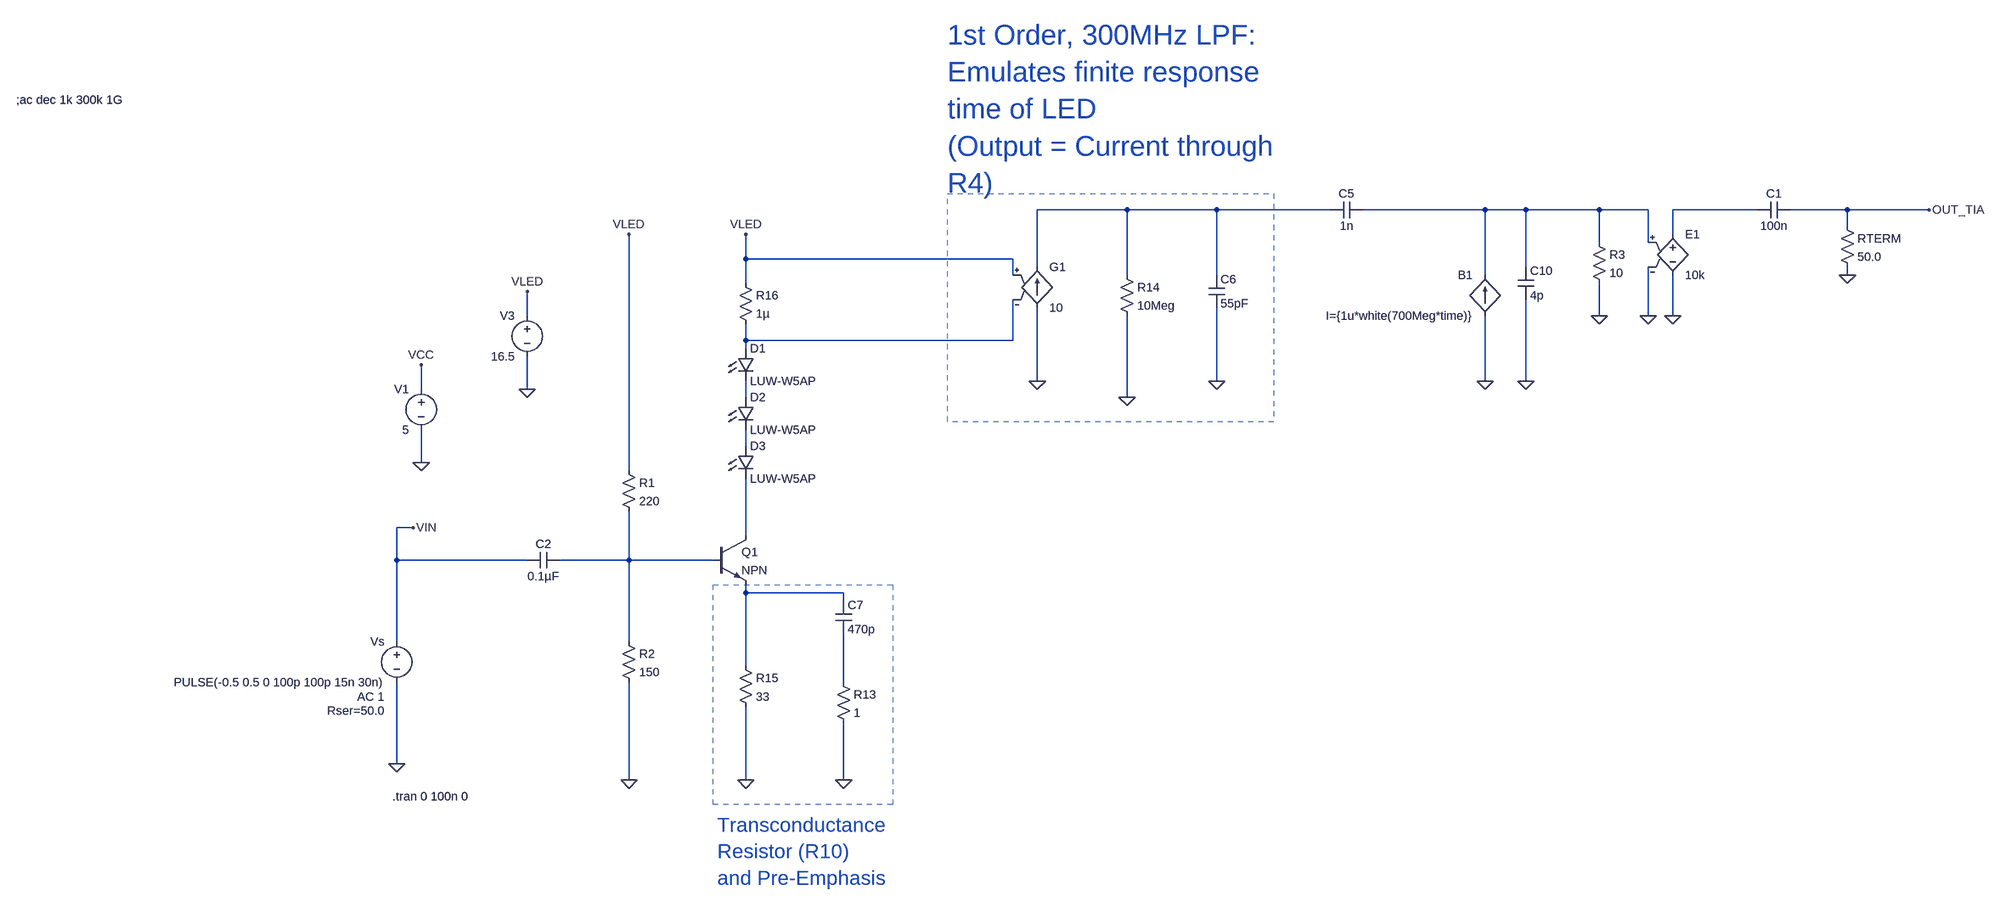
[diagram p0: schematic Transceiver_Schematic_No_Limiting_Amp_Tuned_for_Green_Channel_for_Brice.asc]
Transceiver_Schematic_No_Limiting_Amp_Tuned_for_Green_Channel_for_Brice.asc, the LTspice schematic file:
Version 4
SHEET 1 5332 2548
WIRE 1888 -608 1712 -608
WIRE 2064 -608 1888 -608
WIRE 2352 -608 2064 -608
WIRE 2656 -608 2416 -608
WIRE 2736 -608 2656 -608
WIRE 2880 -608 2736 -608
WIRE 2976 -608 2880 -608
WIRE 3216 -608 3024 -608
WIRE 3392 -608 3280 -608
WIRE 3552 -608 3392 -608
WIRE 3392 -576 3392 -608
WIRE 3024 -560 3024 -608
WIRE 2880 -544 2880 -608
WIRE 2976 -544 2976 -608
WIRE 1120 -512 1120 -560
WIRE 1664 -512 1120 -512
WIRE 1712 -496 1712 -608
WIRE 2736 -496 2736 -608
WIRE 1664 -480 1664 -512
WIRE 1888 -480 1888 -608
WIRE 2064 -480 2064 -608
WIRE 2656 -480 2656 -608
WIRE 3392 -480 3392 -496
WIRE 1120 -464 1120 -512
WIRE 576 -400 576 -448
WIRE 2880 -400 2880 -464
WIRE 2976 -400 2976 -496
WIRE 3024 -400 3024 -480
WIRE 1120 -352 1120 -384
WIRE 1664 -352 1664 -432
WIRE 1664 -352 1120 -352
WIRE 1120 -336 1120 -352
WIRE 1712 -272 1712 -416
WIRE 2064 -272 2064 -416
WIRE 2656 -272 2656 -400
WIRE 2736 -272 2736 -432
WIRE 368 -256 368 -304
WIRE 576 -256 576 -320
WIRE 1120 -240 1120 -272
WIRE 1888 -240 1888 -400
WIRE 1120 -144 1120 -176
WIRE 368 -112 368 -176
WIRE 864 -96 864 -560
WIRE 352 16 320 16
WIRE 1120 32 1120 -80
WIRE 320 80 320 16
WIRE 576 80 320 80
WIRE 864 80 864 -16
WIRE 864 80 640 80
WIRE 1056 80 864 80
WIRE 1120 144 1120 128
WIRE 1312 144 1120 144
WIRE 1312 160 1312 144
WIRE 320 240 320 80
WIRE 864 240 864 80
WIRE 1120 288 1120 144
WIRE 1312 320 1312 224
WIRE 320 480 320 320
WIRE 864 512 864 320
WIRE 1120 512 1120 368
WIRE 1312 512 1312 400
FLAG 368 -304 VCC
FLAG 368 -112 0
FLAG 320 480 0
FLAG 352 16 VIN
FLAG 2064 -272 0
FLAG 1712 -272 0
FLAG 1120 512 0
FLAG 1312 512 0
FLAG 1120 -560 VLED
FLAG 576 -448 VLED
FLAG 576 -256 0
FLAG 3552 -608 OUT_TIA
FLAG 1888 -240 0
FLAG 2656 -272 0
FLAG 2736 -272 0
FLAG 3392 -480 0
FLAG 864 512 0
FLAG 864 -560 VLED
FLAG 3024 -400 0
FLAG 2976 -400 0
FLAG 2880 -400 0
DATAFLAG 1248 144 ""
SYMBOL voltage 368 -272 M0
WINDOW 123 0 0 Left 0
WINDOW 39 0 0 Left 0
SYMATTR InstName V1
SYMATTR Value 5
SYMBOL voltage 320 224 M0
WINDOW 123 24 124 Left 2
WINDOW 39 24 152 Left 2
SYMATTR Value2 AC 1
SYMATTR SpiceLine Rser=50.0
SYMATTR InstName Vs
SYMATTR Value PULSE(-0.5 0.5 0 100p 100p 15n 30n)
SYMBOL LED 1104 -336 R0
SYMATTR InstName D1
SYMATTR Value LUW-W5AP
SYMATTR Description Diode
SYMATTR Type diode
SYMBOL cap 2048 -480 R0
SYMATTR InstName C6
SYMATTR Value 55pF
SYMBOL res 1872 -496 R0
SYMATTR InstName R14
SYMATTR Value 10Meg
SYMBOL res 1104 272 R0
SYMATTR InstName R15
SYMATTR Value 33
SYMBOL cap 1296 160 R0
SYMATTR InstName C7
SYMATTR Value 470p
SYMBOL res 1104 -480 R0
SYMATTR InstName R16
SYMATTR Value 1µ
SYMBOL g 1712 -512 R0
SYMATTR InstName G1
SYMATTR Value 10
SYMBOL LED 1104 -240 R0
SYMATTR InstName D2
SYMATTR Value LUW-W5AP
SYMATTR Description Diode
SYMATTR Type diode
SYMBOL LED 1104 -144 R0
SYMATTR InstName D3
SYMATTR Value LUW-W5AP
SYMATTR Description Diode
SYMATTR Type diode
SYMBOL voltage 576 -416 M0
WINDOW 123 0 0 Left 0
WINDOW 39 0 0 Left 0
SYMATTR InstName V3
SYMATTR Value 16.5
SYMBOL cap 2352 -592 R270
WINDOW 0 32 32 VTop 2
WINDOW 3 0 32 VBottom 2
SYMATTR InstName C5
SYMATTR Value 1n
SYMBOL bi 2656 -400 R180
WINDOW 0 24 80 Left 2
WINDOW 3 24 0 Left 2
SYMATTR InstName B1
SYMATTR Value I={1u*white(700Meg*time)}
SYMBOL cap 2720 -496 R0
SYMATTR InstName C10
SYMATTR Value 4p
SYMBOL res 1296 304 R0
SYMATTR InstName R13
SYMATTR Value 1
SYMBOL res 3376 -592 R0
SYMATTR InstName RTERM
SYMATTR Value 50.0
SYMBOL cap 3280 -624 R90
WINDOW 0 0 32 VBottom 2
WINDOW 3 32 32 VTop 2
SYMATTR InstName C1
SYMATTR Value 100n
SYMBOL cap 640 64 R90
WINDOW 0 0 32 VBottom 2
WINDOW 3 32 32 VTop 2
SYMATTR InstName C2
SYMATTR Value 0.1µF
SYMBOL res 848 -112 R0
SYMATTR InstName R1
SYMATTR Value 220
SYMBOL res 848 224 R0
SYMATTR InstName R2
SYMATTR Value 150
SYMBOL e 3024 -576 R0
SYMATTR InstName E1
SYMATTR Value 10k
SYMBOL res 2864 -560 R0
SYMATTR InstName R3
SYMATTR Value 10
SYMBOL npn 1056 32 R0
SYMATTR InstName Q1
TEXT 312 544 Left 2 !.tran 0 100n 0
TEXT 1064 600 Left 4 ;Transconductance \nResistor (R10)\nand Pre-Emphasis
TEXT 1536 -952 Left 5 ;1st Order, 300MHz LPF:\nEmulates finite response\ntime of LED\n(Output = Current through\nR4)
TEXT -640 -824 Left 2 !;ac dec 1k 300k 1G
RECTANGLE Normal 1408 560 1056 128 2
RECTANGLE Normal 2176 -192 1536 -640 2

The netlist it stands for:
* Transceiver_Schematic_No_Limiting_Amp_Tuned_for_Green_Channel_for_Brice.asc
V1 VCC 0 5
Vs VIN 0 PULSE(-0.5 0.5 0 100p 100p 15n 30n) AC 1 Rser=50.0
D1 N004 N005 LUW-W5AP
C6 N001 0 55pF
R14 N001 0 10Meg
R15 N009 0 33
C7 N009 N010 470p
R16 VLED N004 1µ
G1 0 N001 VLED N004 10
D2 N005 N006 LUW-W5AP
D3 N006 N007 LUW-W5AP
V3 VLED 0 16.5
C5 N001 N002 1n
B1 0 N002 I={1u*white(700Meg*time)}
C10 N002 0 4p
R13 N010 0 1
RTERM OUT_TIA 0 50.0
C1 OUT_TIA N003 100n
C2 N008 VIN 0.1µF
R1 VLED N008 220
R2 N008 0 150
E1 N003 0 N002 0 10k
R3 N002 0 10
Q1 N007 N008 N009 0 NPN
.model D D
.lib standard.dio
.model NPN NPN
.model PNP PNP
.lib standard.bjt
.tran 0 100n 0
* Transconductance
* Resistor (R10)
* and Pre-Emphasis
* 1st Order, 300MHz LPF:
* Emulates finite response
* time of LED
* (Output = Current through
* R4)
;ac dec 1k 300k 1G
.backanno
.end